# EAGLE schematic mono (EAGLE 6.2)
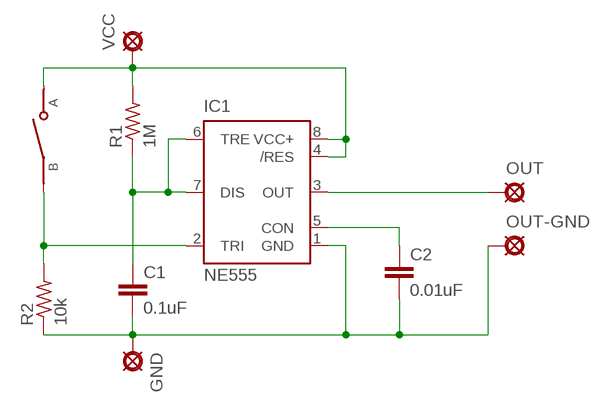
[diagram p0: schematic, sheet 1]

## Parts
C1  0.1uF  050X030_0251  [050X030_025]
C2  0.01uF  050X030_0251  [050X030_025]
GND  PAD8  [OCTOGON]
IC1  NE555  [DIL-08]
OUT  PAD  [SQUARE]
OUT-GND  PAD  [SQUARE]
R1  1M  6MM.4  [R0207/4]
R2  10k  6MM.4  [R0207/4]
SW1  SPST_SWITCH  [SPST_TOGGLE_SWITCH]
VCC  PAD  [SQUARE]

## Nets
N$1: C1.1 IC1.6(TRE) IC1.7(DIS) R1.1
N$2: IC1.3(OUT) OUT.1(PAD)
N$3: IC1.4(/RES) IC1.8(VCC+) R1.2 SW1.A VCC.1(PAD)
N$4: IC1.2(TRI) R2.2 SW1.B
N$5: C2.1 IC1.5(CON)
N$7: C1.2 C2.2 GND.1(PAD) IC1.1(GND) OUT-GND.1(PAD) R2.1

## Library data of the parts
C1 C2 = gm-caps-ceramic:050X030_025: 47 - 120pF Xicon Ceramic Disc 2.5mm lead spacing
GND OUT OUT-GND VCC = gm-supply:PAD: PAD use this package for pads with any purpose, including input, output, send or return various pad shapes: round, square, octogonal, long, and long offset
IC1 = st-microelectronics:NE555: General purpose bipolar Timer; MF: Arrow Electronics; MPN: NE555N; OC_FARNELL: 1467742; OC_NEWARK: 89K1486
R1 R2 = gm-resistors:6MM: 6mm Resistors Leads spaced 1-6 holes apart for 0.1" perfboard. Suitable for 1/4 watt resistors.
SW1 = 00_steve:SPST_SWITCH: SPST Switch Part No.: M101 Source: (http://www.led-switch.com)